# Altium schematic sheet MCU.SchDoc
size A3
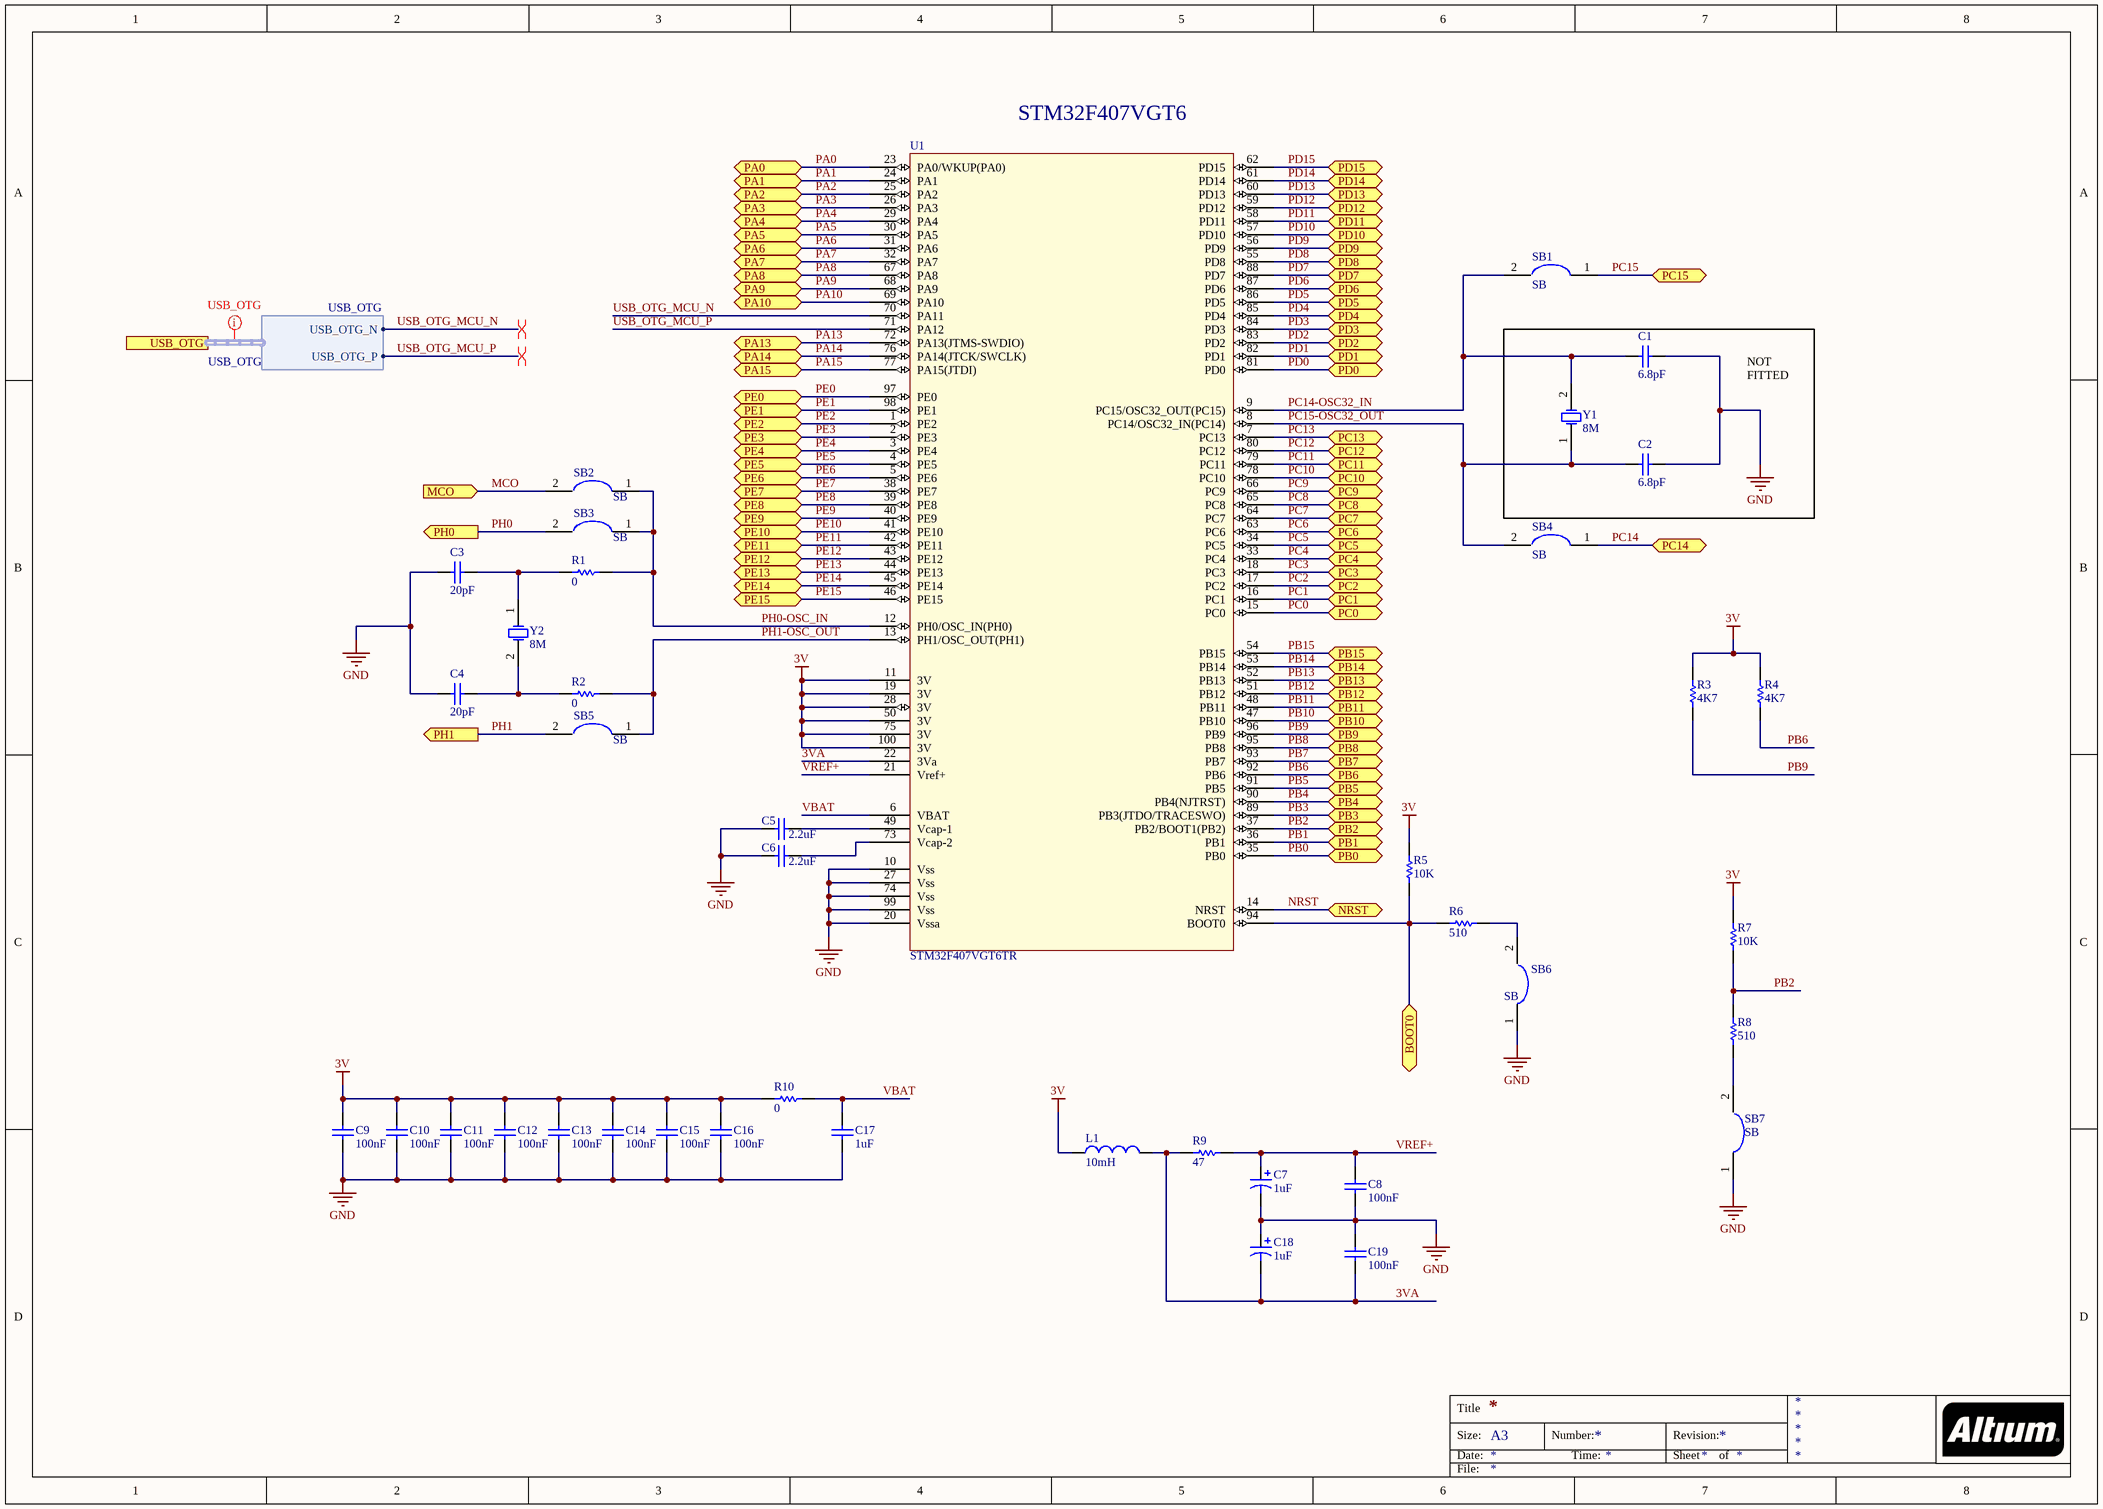
[diagram p0: MCU.SchDoc]

## Parts
C1  value 6.8pF  [CAPC0603B]  (hidden comment: Cap)
C2  value 6.8pF  [CAPC0603B]  (hidden comment: Cap)
C3  value 20pF  [CAPC0603B]  (hidden comment: Cap)
C4  value 20pF  [CAPC0603B]  (hidden comment: Cap)
C5  value 2.2uF  [CAPC0603B]  (hidden comment: Cap)
C6  value 2.2uF  [CAPC0603B]  (hidden comment: Cap)
C7  value 1uF  [TANTALUM CASE A_LEVEL B]  (hidden comment: Cap Pol1)
C8  value 100nF  [CAPC0603B]  (hidden comment: Cap)
C9  value 100nF  [CAPC0603B]  (hidden comment: Cap)
C10  value 100nF  [CAPC0603B]  (hidden comment: Cap)
C11  value 100nF  [CAPC0603B]  (hidden comment: Cap)
C12  value 100nF  [CAPC0603B]  (hidden comment: Cap)
C13  value 100nF  [CAPC0603B]  (hidden comment: Cap)
C14  value 100nF  [CAPC0603B]  (hidden comment: Cap)
C15  value 100nF  [CAPC0603B]  (hidden comment: Cap)
C16  value 100nF  [CAPC0603B]  (hidden comment: Cap)
C17  value 1uF  [CAPC0603B]  (hidden comment: Cap)
C18  value 1uF  [TANTALUM CASE A_LEVEL B]  (hidden comment: Cap Pol1)
C19  value 100nF  [CAPC0603B]  (hidden comment: Cap)
L1  value 10mH  [0402-A]  (hidden comment: Inductor)
R1  value 0  [RESC0603B]  (hidden comment: Res1)
R2  value 0  [RESC0603B]  (hidden comment: Res1)
R3  value 4K7  [RESC0402B]  (hidden comment: Res1)
R4  value 4K7  [RESC0402B]  (hidden comment: Res1)
R5  value 10K  [RESC0603B]  (hidden comment: Res1)
R6  value 510  [RESC0603B]  (hidden comment: Res1)
R7  value 10K  [RESC0603B]  (hidden comment: Res1)
R8  value 510  [RESC0603B]  (hidden comment: Res1)
R9  value 47  [RESC0603B]  (hidden comment: Res1)
R10  value 0  [RESC0603B]  (hidden comment: Res1)
SB1  SB  [SB]
SB2  SB  [SB]
SB3  SB  [SB]
SB4  SB  [SB]
SB5  SB  [SB]
SB6  SB  [SB]
SB7  SB  [SB]
U1  STM32F407VGT6TR  [LQFP100B]
Y1  8M  [HC-49S]
Y2  8M  [HC-49S]

## Ports
BOOT0 (bidir), MCO (in), NRST (bidir), PA0 (bidir), PA1 (bidir), PA2 (bidir), PA3 (bidir), PA4 (bidir), PA5 (bidir), PA6 (bidir), PA7 (bidir), PA8 (bidir), PA9 (bidir), PA10 (bidir), PA13 (bidir), PA14 (bidir), PA15 (bidir), PB0 (bidir), PB1 (bidir), PB2 (bidir), PB3 (bidir), PB4 (bidir), PB5 (bidir), PB6 (bidir), PB7 (bidir), PB8 (bidir), PB9 (bidir), PB10 (bidir), PB11 (bidir), PB12 (bidir), PB13 (bidir), PB14 (bidir), PB15 (bidir), PC0 (bidir), PC1 (bidir), PC2 (bidir), PC3 (bidir), PC4 (bidir), PC5 (bidir), PC6 (bidir), PC7 (bidir), PC8 (bidir), PC9 (bidir), PC10 (bidir), PC11 (bidir), PC12 (bidir), PC13 (bidir), PC14 (bidir), PC15 (bidir), PD0 (bidir), PD1 (bidir), PD2 (bidir), PD3 (bidir), PD4 (bidir), PD5 (bidir), PD6 (bidir), PD7 (bidir), PD8 (bidir), PD9 (bidir), PD10 (bidir), PD11 (bidir), PD12 (bidir), PD13 (bidir), PD14 (bidir), PD15 (bidir), PE0 (bidir), PE1 (bidir), PE2 (bidir), PE3 (bidir), PE4 (bidir), PE5 (bidir), PE6 (bidir), PE7 (bidir), PE8 (bidir), PE9 (bidir), PE10 (bidir), PE11 (bidir), PE12 (bidir), PE13 (bidir), PE14 (bidir), PE15 (bidir), PH0 (out), PH1 (out), USB_OTG (harness USB_OTG)

## Harnesses
USB_OTG: USB_OTG_N, USB_OTG_P

## Nets
3V: C9.2 C10.2 C11.2 C12.2 C13.2 C14.2 C15.2 C16.2 L1.1 R3.2 R4.2 R5.2 R7.2 R10.1 U1.11(3V) U1.19(3V) U1.28(3V) U1.50(3V) U1.75(3V) U1.100(3V)
GND: C1.2 C2.2 C3.1 C4.1 C5.2 C6.2 C7.2 C8.1 C9.1 C10.1 C11.1 C12.1 C13.1 C14.1 C15.1 C16.1 C17.2 C18.1 C19.2 SB6.1 SB7.1 U1.10(Vss) U1.20(Vssa) U1.27(Vss) U1.74(Vss) U1.99(Vss)
3VA: C18.2 C19.1 L1.2 R9.1 U1.22(3Va)
BOOT0: R5.1 R6.1 U1.94(BOOT0) ; port BOOT0
MCO: SB2.2 ; port MCO
NRST: U1.14(NRST) ; port NRST
PA0: U1.23(PA0/WKUP(PA0)) ; port PA0
PA1: U1.24(PA1) ; port PA1
PA2: U1.25(PA2) ; port PA2
PA3: U1.26(PA3) ; port PA3
PA4: U1.29(PA4) ; port PA4
PA5: U1.30(PA5) ; port PA5
PA6: U1.31(PA6) ; port PA6
PA7: U1.32(PA7) ; port PA7
PA8: U1.67(PA8) ; port PA8
PA9: U1.68(PA9) ; port PA9
PA10: U1.69(PA10) ; port PA10
PA13: U1.72(PA13(JTMS-SWDIO)) ; port PA13
PA14: U1.76(PA14(JTCK/SWCLK)) ; port PA14
PA15: U1.77(PA15(JTDI)) ; port PA15
PB0: U1.35(PB0) ; port PB0
PB1: U1.36(PB1) ; port PB1
PB2: R7.1 R8.1 U1.37(PB2/BOOT1(PB2)) ; port PB2
PB3: U1.89(PB3(JTDO/TRACESWO)) ; port PB3
PB4: U1.90(PB4(NJTRST)) ; port PB4
PB5: U1.91(PB5) ; port PB5
PB6: R4.1 U1.92(PB6) ; port PB6
PB7: U1.93(PB7) ; port PB7
PB8: U1.95(PB8) ; port PB8
PB9: R3.1 U1.96(PB9) ; port PB9
PB10: U1.47(PB10) ; port PB10
PB11: U1.48(PB11) ; port PB11
PB12: U1.51(PB12) ; port PB12
PB13: U1.52(PB13) ; port PB13
PB14: U1.53(PB14) ; port PB14
PB15: U1.54(PB15) ; port PB15
PC0: U1.15(PC0) ; port PC0
PC1: U1.16(PC1) ; port PC1
PC2: U1.17(PC2) ; port PC2
PC3: U1.18(PC3) ; port PC3
PC4: U1.33(PC4) ; port PC4
PC5: U1.34(PC5) ; port PC5
PC6: U1.63(PC6) ; port PC6
PC7: U1.64(PC7) ; port PC7
PC8: U1.65(PC8) ; port PC8
PC9: U1.66(PC9) ; port PC9
PC10: U1.78(PC10) ; port PC10
PC11: U1.79(PC11) ; port PC11
PC12: U1.80(PC12) ; port PC12
PC13: U1.7(PC13) ; port PC13
PC14: SB4.1 ; port PC14
PC14-OSC32_IN: C1.1 SB1.2 U1.9(PC15/OSC32_OUT(PC15)) Y1.2(OSC2)
PC15: SB1.1 ; port PC15
PC15-OSC32_OUT: C2.1 SB4.2 U1.8(PC14/OSC32_IN(PC14)) Y1.1(OSC1)
PD0: U1.81(PD0) ; port PD0
PD1: U1.82(PD1) ; port PD1
PD2: U1.83(PD2) ; port PD2
PD3: U1.84(PD3) ; port PD3
PD4: U1.85(PD4) ; port PD4
PD5: U1.86(PD5) ; port PD5
PD6: U1.87(PD6) ; port PD6
PD7: U1.88(PD7) ; port PD7
PD8: U1.55(PD8) ; port PD8
PD9: U1.56(PD9) ; port PD9
PD10: U1.57(PD10) ; port PD10
PD11: U1.58(PD11) ; port PD11
PD12: U1.59(PD12) ; port PD12
PD13: U1.60(PD13) ; port PD13
PD14: U1.61(PD14) ; port PD14
PD15: U1.62(PD15) ; port PD15
PE0: U1.97(PE0) ; port PE0
PE1: U1.98(PE1) ; port PE1
PE2: U1.1(PE2) ; port PE2
PE3: U1.2(PE3) ; port PE3
PE4: U1.3(PE4) ; port PE4
PE5: U1.4(PE5) ; port PE5
PE6: U1.5(PE6) ; port PE6
PE7: U1.38(PE7) ; port PE7
PE8: U1.39(PE8) ; port PE8
PE9: U1.40(PE9) ; port PE9
PE10: U1.41(PE10) ; port PE10
PE11: U1.42(PE11) ; port PE11
PE12: U1.43(PE12) ; port PE12
PE13: U1.44(PE13) ; port PE13
PE14: U1.45(PE14) ; port PE14
PE15: U1.46(PE15) ; port PE15
PH0: SB3.2 ; port PH0
PH0-OSC_IN: R1.2 SB2.1 SB3.1 U1.12(PH0/OSC_IN(PH0))
PH1: SB5.2 ; port PH1
PH1-OSC_OUT: R2.2 SB5.1 U1.13(PH1/OSC_OUT(PH1))
USB_OTG_MCU_N: U1.70(PA11) ; port USB_OTG.USB_OTG_N
USB_OTG_MCU_P: U1.71(PA12) ; port USB_OTG.USB_OTG_P
VBAT: C17.1 R10.2 U1.6(VBAT)
VREF+: C7.1 C8.2 R9.2 U1.21(Vref+)
NetC3_2: C3.2 R1.1 Y2.1(OSC1)
NetC4_2: C4.2 R2.1 Y2.2(OSC2)
NetC5_1: C5.1 U1.49(Vcap-1)
NetC6_1: C6.1 U1.73(Vcap-2)
NetR6_2: R6.2 SB6.2
NetR8_2: R8.2 SB7.2

## Layout directives
differential pair: USB_OTG_MCU_N, USB_OTG_MCU_P
net class USB_OTG: (no net found under the mark)

## Notes on the sheet
- (near U1) STM32F407VGT6
- NOT
- FITTED
- Title
- Size:
- Date:
- A3
- Number:
- Time:
- Revision:
- Sheet
- of
- File:

## Library data of the parts
C1 C2 = Cap_1: Capacitor; Published: 8-Jun-2000; LatestRevisionDate: 17-Jul-2002; LatestRevisionNote: Re-released for DXP Platform.; PackageReference: RAD-0.3; Publisher: Altium Limited; PackageDescription: Radial Cap, Thru-Hole; 2 Leads; 0.3 in Pin Spacing
C3 C4 = Cap: Capacitor; Published: 8-Jun-2000; LatestRevisionDate: 17-Jul-2002; LatestRevisionNote: Re-released for DXP Platform.; PackageReference: RAD-0.3; Publisher: Altium Limited; PackageDescription: Radial Cap, Thru-Hole; 2 Leads; 0.3 in Pin Spacing
C5 C6 = Cap_2: Capacitor; Published: 8-Jun-2000; LatestRevisionDate: 17-Jul-2002; LatestRevisionNote: Re-released for DXP Platform.; PackageReference: RAD-0.3; Publisher: Altium Limited; PackageDescription: Radial Cap, Thru-Hole; 2 Leads; 0.3 in Pin Spacing
C7 C18 = Cap Pol1: Polarized Capacitor (Radial); Published: 8-Jun-2000; LatestRevisionDate: 17-Jul-2002; LatestRevisionNote: Re-released for DXP Platform.; PackageReference: RB7.6-15; Publisher: Altium Limited; PackageDescription: Polarized Capacitor (Radial); 2 Leads
C8-C16 C19 = Cap_3: Capacitor; Published: 8-Jun-2000; LatestRevisionDate: 17-Jul-2002; LatestRevisionNote: Re-released for DXP Platform.; PackageReference: RAD-0.3; Publisher: Altium Limited; PackageDescription: Radial Cap, Thru-Hole; 2 Leads; 0.3 in Pin Spacing
C17 = Cap_4: Capacitor; Published: 8-Jun-2000; LatestRevisionDate: 17-Jul-2002; LatestRevisionNote: Re-released for DXP Platform.; PackageReference: RAD-0.3; Publisher: Altium Limited; PackageDescription: Radial Cap, Thru-Hole; 2 Leads; 0.3 in Pin Spacing
L1 = Inductor: Code_IEC: 1005; Published: 8-Jun-2000; LatestRevisionDate: 29-May-2009; LatestRevisionNote: IPC-7351 Footprint Added.; PackageReference: 0402-A; Publisher: Altium Limited; PackageDescription: Chip Inductor; Code_JEITA: 0402
R1 R2 R10 = Res1: Resistor; Published: 8-Jun-2000; LatestRevisionDate: 17-Jul-2002; LatestRevisionNote: Re-released for DXP Platform.; PackageReference: AXIAL-0.3; Publisher: Altium Limited; PackageDescription: Axial Device, Thru-Hole; 2 Leads; 0.3 in Pin Spacing
R3 R4 = Res1_16: Resistor; Published: 8-Jun-2000; LatestRevisionDate: 17-Jul-2002; LatestRevisionNote: Re-released for DXP Platform.; PackageReference: AXIAL-0.3; Publisher: Altium Limited; PackageDescription: Axial Device, Thru-Hole; 2 Leads; 0.3 in Pin Spacing
R5 R7 = Res1_2: Resistor; Published: 8-Jun-2000; LatestRevisionDate: 17-Jul-2002; LatestRevisionNote: Re-released for DXP Platform.; PackageReference: AXIAL-0.3; Publisher: Altium Limited; PackageDescription: Axial Device, Thru-Hole; 2 Leads; 0.3 in Pin Spacing
R6 R8 = Res1_1: Resistor; Published: 8-Jun-2000; LatestRevisionDate: 17-Jul-2002; LatestRevisionNote: Re-released for DXP Platform.; PackageReference: AXIAL-0.3; Publisher: Altium Limited; PackageDescription: Axial Device, Thru-Hole; 2 Leads; 0.3 in Pin Spacing
R9 = Res1_3: Resistor; Published: 8-Jun-2000; LatestRevisionDate: 17-Jul-2002; LatestRevisionNote: Re-released for DXP Platform.; PackageReference: AXIAL-0.3; Publisher: Altium Limited; PackageDescription: Axial Device, Thru-Hole; 2 Leads; 0.3 in Pin Spacing
U1 = STM32F407VGT6TR: STMICROELECTRONICS - STM32F407VGT6TR - MCU, 32BIT, CORTEX-M4, 168MHZ, LQFP-100; Architecture: ARM Cortex-M4; CPU Speed: 168; Program Memory Size: 1; RAM Memory Size: 192; No. of Pins: 100; MCU Case Style: LQFP; No. of I/O's: 82; Embedded Interface Type: CAN, I2; Supply Voltage Min: 1.8; Supply Voltage Max: 3.6; Product Range: STM32 F4 ARM Cortex-M4 Microcontrollers; SVHC: No SVHC (17-Dec-2015); Controller Family/Series: STM32; MPU Core Size: 32; Peripherals: ADC, DAC, RTC; Supplier 1: Farnell; Manufacturer: STMICROELECTRONICS; Manufacturer Part Number: STM32F407VGT6TR; RoHS: YES; Stock 1: 521; Pricing 1: 1=9.65, 10=8.36, 25=8.02, 50=7.59, 100=7.06, 250=6.62, 500=6.19, 1000=5.76 (GBP); Packaging: Cut Tape; Automotive Qualification Standard: -; MSL: MSL 3 - 168 hours; Operating Temperature Max: 85; Operating Temperature Min: -40; ComponentLink1URL: http://www.farnell.com/datasheets/1994630.pdf; ComponentLink1Description: http://www.farnell.com/datasheets/1994630.pdf; ComponentLink2URL: http://www.farnell.com/datasheets/2042748.pdf; ComponentLink2Description: http://www.farnell.com/datasheets/2042748.pdf; Supplier Part Number 1: 2333297
Y1 Y2 = XTAL: Crystal Oscillator; Published: 8-Jun-2000; LatestRevisionDate: 17-Jul-2002; LatestRevisionNote: Re-released for DXP Platform.; PackageReference: R38; Publisher: Altium Limited; PackageDescription: Crystal, Thru-Hole; 2 Leads; Body 3.1 x 8.2 mm (Dia.xH)